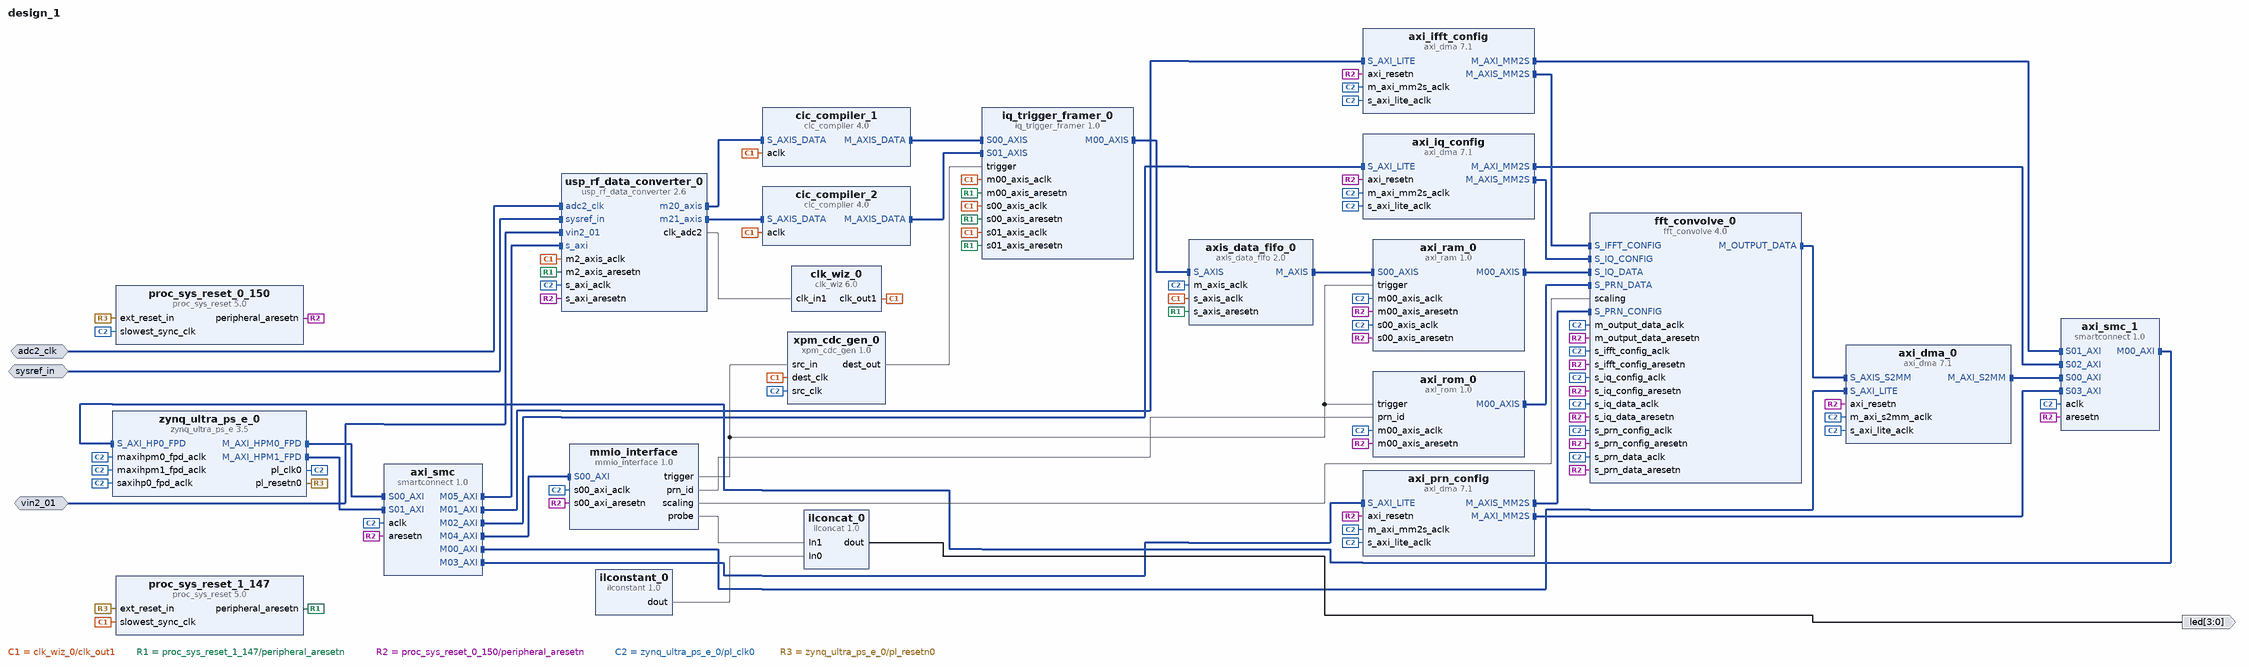
[diagram p0: block diagram of the top level]
# Vivado block design design_1, xczu48dr-ffvg1517-2-e, Vivado 2025.1
create_bd_design design_1

create_bd_intf_port -mode Slave -vlnv xilinx.com:display_usp_rf_data_converter:diff_pins_rtl:1.0 sysref_in
create_bd_intf_port -mode Slave -vlnv xilinx.com:interface:diff_clock_rtl:1.0 adc2_clk
set_property -dict {CONFIG.FREQ_HZ 491520000.0} [get_bd_intf_ports adc2_clk]
create_bd_intf_port -mode Slave -vlnv xilinx.com:interface:diff_analog_io_rtl:1.0 vin2_01
create_bd_port -dir O -from 3 -to 0 led

create_bd_cell -type ip -vlnv xilinx.com:ip:zynq_ultra_ps_e:3.5 zynq_ultra_ps_e_0
set_property -dict [list \
  CONFIG.PSU_BANK_0_IO_STANDARD LVCMOS33 \
  CONFIG.PSU_BANK_1_IO_STANDARD LVCMOS18 \
  CONFIG.PSU_BANK_2_IO_STANDARD LVCMOS18 \
  CONFIG.PSU_BANK_3_IO_STANDARD LVCMOS18 \
  CONFIG.PSU_USB3__DUAL_CLOCK_ENABLE 1 \
  CONFIG.PSU__CAN1__PERIPHERAL__ENABLE 0 \
  CONFIG.PSU__CRF_APB__ACPU_CTRL__FREQMHZ 1200 \
  CONFIG.PSU__CRF_APB__ACPU_CTRL__SRCSEL APLL \
  CONFIG.PSU__CRF_APB__APLL_CTRL__SRCSEL PSS_REF_CLK \
  CONFIG.PSU__CRF_APB__DBG_FPD_CTRL__FREQMHZ 250 \
  CONFIG.PSU__CRF_APB__DBG_FPD_CTRL__SRCSEL IOPLL \
  CONFIG.PSU__CRF_APB__DBG_TRACE_CTRL__FREQMHZ 250 \
  CONFIG.PSU__CRF_APB__DBG_TSTMP_CTRL__FREQMHZ 250 \
  CONFIG.PSU__CRF_APB__DBG_TSTMP_CTRL__SRCSEL IOPLL \
  CONFIG.PSU__CRF_APB__DDR_CTRL__FREQMHZ 1200 \
  CONFIG.PSU__CRF_APB__DDR_CTRL__SRCSEL DPLL \
  CONFIG.PSU__CRF_APB__DPDMA_REF_CTRL__FREQMHZ 600 \
  CONFIG.PSU__CRF_APB__DPDMA_REF_CTRL__SRCSEL DPLL \
  CONFIG.PSU__CRF_APB__DPLL_CTRL__SRCSEL PSS_REF_CLK \
  CONFIG.PSU__CRF_APB__DP_AUDIO_REF_CTRL__SRCSEL RPLL \
  CONFIG.PSU__CRF_APB__DP_STC_REF_CTRL__SRCSEL RPLL \
  CONFIG.PSU__CRF_APB__GDMA_REF_CTRL__FREQMHZ 600 \
  CONFIG.PSU__CRF_APB__GDMA_REF_CTRL__SRCSEL DPLL \
  CONFIG.PSU__CRF_APB__GPU_REF_CTRL__FREQMHZ 600 \
  CONFIG.PSU__CRF_APB__TOPSW_LSBUS_CTRL__FREQMHZ 100 \
  CONFIG.PSU__CRF_APB__TOPSW_LSBUS_CTRL__SRCSEL IOPLL \
  CONFIG.PSU__CRF_APB__TOPSW_MAIN_CTRL__FREQMHZ 533.33 \
  CONFIG.PSU__CRF_APB__TOPSW_MAIN_CTRL__SRCSEL DPLL \
  CONFIG.PSU__CRF_APB__VPLL_CTRL__SRCSEL PSS_REF_CLK \
  CONFIG.PSU__CRL_APB__ADMA_REF_CTRL__FREQMHZ 533.333 \
  CONFIG.PSU__CRL_APB__ADMA_REF_CTRL__SRCSEL RPLL \
  CONFIG.PSU__CRL_APB__CAN1_REF_CTRL__SRCSEL IOPLL \
  CONFIG.PSU__CRL_APB__CPU_R5_CTRL__FREQMHZ 500 \
  CONFIG.PSU__CRL_APB__CPU_R5_CTRL__SRCSEL IOPLL \
  CONFIG.PSU__CRL_APB__DBG_LPD_CTRL__FREQMHZ 250 \
  CONFIG.PSU__CRL_APB__DBG_LPD_CTRL__SRCSEL IOPLL \
  CONFIG.PSU__CRL_APB__GEM3_REF_CTRL__FREQMHZ 125 \
  CONFIG.PSU__CRL_APB__GEM3_REF_CTRL__SRCSEL IOPLL \
  CONFIG.PSU__CRL_APB__I2C1_REF_CTRL__FREQMHZ 100 \
  CONFIG.PSU__CRL_APB__I2C1_REF_CTRL__SRCSEL IOPLL \
  CONFIG.PSU__CRL_APB__IOPLL_CTRL__SRCSEL PSS_REF_CLK \
  CONFIG.PSU__CRL_APB__IOU_SWITCH_CTRL__FREQMHZ 267 \
  CONFIG.PSU__CRL_APB__IOU_SWITCH_CTRL__SRCSEL RPLL \
  CONFIG.PSU__CRL_APB__LPD_LSBUS_CTRL__FREQMHZ 100 \
  CONFIG.PSU__CRL_APB__LPD_LSBUS_CTRL__SRCSEL IOPLL \
  CONFIG.PSU__CRL_APB__LPD_SWITCH_CTRL__FREQMHZ 533.333 \
  CONFIG.PSU__CRL_APB__LPD_SWITCH_CTRL__SRCSEL RPLL \
  CONFIG.PSU__CRL_APB__PCAP_CTRL__FREQMHZ 200 \
  CONFIG.PSU__CRL_APB__PCAP_CTRL__SRCSEL IOPLL \
  CONFIG.PSU__CRL_APB__PL0_REF_CTRL__FREQMHZ 150 \
  CONFIG.PSU__CRL_APB__PL0_REF_CTRL__SRCSEL RPLL \
  CONFIG.PSU__CRL_APB__QSPI_REF_CTRL__FREQMHZ 125 \
  CONFIG.PSU__CRL_APB__RPLL_CTRL__SRCSEL PSS_REF_CLK \
  CONFIG.PSU__CRL_APB__SDIO0_REF_CTRL__SRCSEL IOPLL \
  CONFIG.PSU__CRL_APB__SDIO1_REF_CTRL__FREQMHZ 200 \
  CONFIG.PSU__CRL_APB__SDIO1_REF_CTRL__SRCSEL IOPLL \
  CONFIG.PSU__CRL_APB__SPI0_REF_CTRL__SRCSEL IOPLL \
  CONFIG.PSU__CRL_APB__SPI1_REF_CTRL__SRCSEL IOPLL \
  CONFIG.PSU__CRL_APB__TIMESTAMP_REF_CTRL__FREQMHZ 100 \
  CONFIG.PSU__CRL_APB__TIMESTAMP_REF_CTRL__SRCSEL PSS_REF_CLK \
  CONFIG.PSU__CRL_APB__UART0_REF_CTRL__FREQMHZ 100 \
  CONFIG.PSU__CRL_APB__UART0_REF_CTRL__SRCSEL IOPLL \
  CONFIG.PSU__CRL_APB__USB0_BUS_REF_CTRL__FREQMHZ 250 \
  CONFIG.PSU__CRL_APB__USB0_BUS_REF_CTRL__SRCSEL IOPLL \
  CONFIG.PSU__CRL_APB__USB3_DUAL_REF_CTRL__FREQMHZ 20 \
  CONFIG.PSU__CRL_APB__USB3_DUAL_REF_CTRL__SRCSEL IOPLL \
  CONFIG.PSU__CRL_APB__USB3__ENABLE 1 \
  CONFIG.PSU__DDRC__BUS_WIDTH {64 Bit} \
  CONFIG.PSU__DDRC__COMPONENTS Components \
  CONFIG.PSU__DDRC__DEVICE_CAPACITY {8192 MBits} \
  CONFIG.PSU__DDRC__DRAM_WIDTH {16 Bits} \
  CONFIG.PSU__DDRC__ECC Disabled \
  CONFIG.PSU__DDRC__MEMORY_TYPE {DDR 4} \
  CONFIG.PSU__DDRC__SPEED_BIN DDR4_2400R \
  CONFIG.PSU__DDR_HIGH_ADDRESS_GUI_ENABLE 1 \
  CONFIG.PSU__DDR__INTERFACE__FREQMHZ 600.000 \
  CONFIG.PSU__DISPLAYPORT__LANE0__ENABLE 1 \
  CONFIG.PSU__DISPLAYPORT__LANE0__IO {GT Lane1} \
  CONFIG.PSU__DISPLAYPORT__LANE1__ENABLE 1 \
  CONFIG.PSU__DISPLAYPORT__LANE1__IO {GT Lane0} \
  CONFIG.PSU__DISPLAYPORT__PERIPHERAL__ENABLE 1 \
  CONFIG.PSU__DLL__ISUSED 1 \
  CONFIG.PSU__DPAUX__PERIPHERAL__ENABLE 1 \
  CONFIG.PSU__DPAUX__PERIPHERAL__IO {MIO 27 .. 30} \
  CONFIG.PSU__DP__LANE_SEL {Dual Lower} \
  CONFIG.PSU__DP__REF_CLK_FREQ 27 \
  CONFIG.PSU__DP__REF_CLK_SEL {Ref Clk0} \
  CONFIG.PSU__ENET1__GRP_MDIO__ENABLE 1 \
  CONFIG.PSU__ENET1__GRP_MDIO__IO {MIO 50 .. 51} \
  CONFIG.PSU__ENET1__PERIPHERAL__ENABLE 1 \
  CONFIG.PSU__ENET1__PERIPHERAL__IO {MIO 38 .. 49} \
  CONFIG.PSU__FPGA_PL0_ENABLE 1 \
  CONFIG.PSU__GEM__TSU__ENABLE 0 \
  CONFIG.PSU__GPIO0_MIO__PERIPHERAL__ENABLE 0 \
  CONFIG.PSU__GPIO1_MIO__PERIPHERAL__ENABLE 0 \
  CONFIG.PSU__GT__LINK_SPEED HBR \
  CONFIG.PSU__GT__PRE_EMPH_LVL_4 0 \
  CONFIG.PSU__GT__VLT_SWNG_LVL_4 0 \
  CONFIG.PSU__I2C0__PERIPHERAL__ENABLE 1 \
  CONFIG.PSU__I2C0__PERIPHERAL__IO {MIO 18 .. 19} \
  CONFIG.PSU__I2C1__PERIPHERAL__ENABLE 1 \
  CONFIG.PSU__I2C1__PERIPHERAL__IO {MIO 36 .. 37} \
  CONFIG.PSU__MAXIGP0__DATA_WIDTH 128 \
  CONFIG.PSU__OVERRIDE__BASIC_CLOCK 0 \
  CONFIG.PSU__PMU__PERIPHERAL__ENABLE 0 \
  CONFIG.PSU__PRESET_APPLIED 1 \
  CONFIG.PSU__PSS_REF_CLK__FREQMHZ 33.33333 \
  CONFIG.PSU__QSPI__PERIPHERAL__ENABLE 0 \
  CONFIG.PSU__SD0__CLK_100_SDR_OTAP_DLY 0x0 \
  CONFIG.PSU__SD0__CLK_200_SDR_OTAP_DLY 0x0 \
  CONFIG.PSU__SD0__CLK_50_DDR_ITAP_DLY 0x0 \
  CONFIG.PSU__SD0__CLK_50_DDR_OTAP_DLY 0x0 \
  CONFIG.PSU__SD0__CLK_50_SDR_ITAP_DLY 0x15 \
  CONFIG.PSU__SD0__CLK_50_SDR_OTAP_DLY 0x5 \
  CONFIG.PSU__SPI0__GRP_SS0__IO {MIO 3} \
  CONFIG.PSU__SPI0__GRP_SS1__ENABLE 1 \
  CONFIG.PSU__SPI0__GRP_SS1__IO {MIO 2} \
  CONFIG.PSU__SPI0__GRP_SS2__ENABLE 1 \
  CONFIG.PSU__SPI0__GRP_SS2__IO {MIO 1} \
  CONFIG.PSU__SPI0__PERIPHERAL__ENABLE 1 \
  CONFIG.PSU__SPI0__PERIPHERAL__IO {MIO 0 .. 5} \
  CONFIG.PSU__SPI1__GRP_SS0__IO {MIO 9} \
  CONFIG.PSU__SPI1__PERIPHERAL__ENABLE 1 \
  CONFIG.PSU__SPI1__PERIPHERAL__IO {MIO 6 .. 11} \
  CONFIG.PSU__TSU__BUFG_PORT_PAIR 0 \
  CONFIG.PSU__UART0__PERIPHERAL__ENABLE 0 \
  CONFIG.PSU__UART1__BAUD_RATE 115200 \
  CONFIG.PSU__UART1__MODEM__ENABLE 0 \
  CONFIG.PSU__UART1__PERIPHERAL__ENABLE 1 \
  CONFIG.PSU__UART1__PERIPHERAL__IO {MIO 32 .. 33} \
  CONFIG.PSU__USB0_COHERENCY 0 \
  CONFIG.PSU__USB0__PERIPHERAL__ENABLE 1 \
  CONFIG.PSU__USB0__PERIPHERAL__IO {MIO 52 .. 63} \
  CONFIG.PSU__USB0__REF_CLK_FREQ 100 \
  CONFIG.PSU__USB0__REF_CLK_SEL {Ref Clk1} \
  CONFIG.PSU__USB1__PERIPHERAL__ENABLE 1 \
  CONFIG.PSU__USB1__PERIPHERAL__IO {MIO 64 .. 75} \
  CONFIG.PSU__USB1__REF_CLK_FREQ 100 \
  CONFIG.PSU__USB1__REF_CLK_SEL {Ref Clk1} \
  CONFIG.PSU__USB2_0__EMIO__ENABLE 0 \
  CONFIG.PSU__USB3_0__EMIO__ENABLE 0 \
  CONFIG.PSU__USB3_0__PERIPHERAL__ENABLE 1 \
  CONFIG.PSU__USB3_0__PERIPHERAL__IO {GT Lane2} \
  CONFIG.PSU__USB3_1__PERIPHERAL__ENABLE 1 \
  CONFIG.PSU__USB3_1__PERIPHERAL__IO {GT Lane3} \
  CONFIG.PSU__USB__RESET__MODE {Boot Pin} \
  CONFIG.PSU__USB__RESET__POLARITY {Active Low} \
  CONFIG.PSU__USE__IRQ0 1 \
  CONFIG.PSU__USE__IRQ1 1 \
  CONFIG.PSU__USE__M_AXI_GP0 1 \
  CONFIG.PSU__USE__M_AXI_GP1 1 \
  CONFIG.PSU__USE__M_AXI_GP2 0 \
  CONFIG.PSU__USE__S_AXI_GP2 1 \
] [get_bd_cells zynq_ultra_ps_e_0]
# 103 more settings of zynq_ultra_ps_e_0 are not shown: defaults, MIO pin electricals, DDR timing, and values the tool derives
create_bd_cell -type ip -vlnv xilinx.com:ip:axi_dma:7.1 axi_dma_0
set_property -dict {CONFIG.c_include_mm2s 0 CONFIG.c_include_sg 0 CONFIG.c_sg_length_width 23} [get_bd_cells axi_dma_0]
create_bd_cell -type ip -vlnv xilinx.com:ip:clk_wiz:6.0 clk_wiz_0
set_property -dict [list \
  CONFIG.CLKIN1_JITTER_PS 39.06 \
  CONFIG.CLKOUT1_JITTER 131.681 \
  CONFIG.CLKOUT1_PHASE_ERROR 150.915 \
  CONFIG.CLKOUT1_REQUESTED_OUT_FREQ 102.4 \
  CONFIG.MMCM_CLKFBOUT_MULT_F 23.500 \
  CONFIG.MMCM_CLKIN1_PERIOD 3.906 \
  CONFIG.MMCM_CLKIN2_PERIOD 10.0 \
  CONFIG.MMCM_CLKOUT0_DIVIDE_F 11.750 \
  CONFIG.MMCM_DIVCLK_DIVIDE 5 \
  CONFIG.PRIM_IN_FREQ 256 \
  CONFIG.PRIM_SOURCE Single_ended_clock_capable_pin \
  CONFIG.USE_LOCKED false \
  CONFIG.USE_RESET false \
] [get_bd_cells clk_wiz_0]
create_bd_cell -type ip -vlnv xilinx.com:ip:axis_data_fifo:2.0 axis_data_fifo_0
set_property -dict [list \
  CONFIG.FIFO_DEPTH 4096 \
  CONFIG.HAS_TLAST 1 \
  CONFIG.IS_ACLK_ASYNC 1 \
  CONFIG.TDATA_NUM_BYTES 4 \
] [get_bd_cells axis_data_fifo_0]
create_bd_cell -type ip -vlnv xilinx.com:ip:proc_sys_reset:5.0 proc_sys_reset_0_150
create_bd_cell -type ip -vlnv xilinx.com:ip:proc_sys_reset:5.0 proc_sys_reset_1_147
create_bd_cell -type ip -vlnv xilinx.com:ip:usp_rf_data_converter:2.6 usp_rf_data_converter_0
set_property -dict [list \
  CONFIG.ADC226_En true \
  CONFIG.ADC2_Clock_Dist 2 \
  CONFIG.Axiclk_Freq 150 \
  CONFIG.Converter_Setup 0 \
  CONFIG.RF_Analyzer 0 \
  CONFIG.mADC_CalOpt_Mode00 2 \
  CONFIG.mADC_Data_Type00 1 \
  CONFIG.mADC_Data_Width00 1 \
  CONFIG.mADC_Decimation_Mode00 40 \
  CONFIG.mADC_Dither00 false \
  CONFIG.mADC_Mixer_Type00 2 \
  CONFIG.mADC_Outclk_Freq 256.000 \
  CONFIG.mADC_PLL_Enable true \
  CONFIG.mADC_Refclk_Freq 491.520 \
  CONFIG.mADC_Sampling_Rate 4.096 \
  CONFIG.mADC_Slice00_Enable true \
] [get_bd_cells usp_rf_data_converter_0]
create_bd_cell -type ip -vlnv xilinx.com:ip:cic_compiler:4.0 cic_compiler_1
set_property -dict [list \
  CONFIG.Clock_Frequency 102.4 \
  CONFIG.Filter_Type Decimation \
  CONFIG.Fixed_Or_Initial_Rate 25 \
  CONFIG.Input_Data_Width 16 \
  CONFIG.Input_Sample_Frequency 102.4 \
  CONFIG.Maximum_Rate 25 \
  CONFIG.Minimum_Rate 25 \
  CONFIG.Number_Of_Stages 6 \
  CONFIG.Output_Data_Width 16 \
  CONFIG.Quantization Truncation \
  CONFIG.SamplePeriod 1 \
  CONFIG.Sample_Rate_Changes Fixed \
] [get_bd_cells cic_compiler_1]
create_bd_cell -type ip -vlnv xilinx.com:ip:cic_compiler:4.0 cic_compiler_2
set_property -dict [list \
  CONFIG.Clock_Frequency 102.4 \
  CONFIG.Filter_Type Decimation \
  CONFIG.Fixed_Or_Initial_Rate 25 \
  CONFIG.Input_Data_Width 16 \
  CONFIG.Input_Sample_Frequency 102.4 \
  CONFIG.Maximum_Rate 25 \
  CONFIG.Minimum_Rate 25 \
  CONFIG.Number_Of_Stages 6 \
  CONFIG.Output_Data_Width 16 \
  CONFIG.Quantization Truncation \
  CONFIG.SamplePeriod 1 \
  CONFIG.Sample_Rate_Changes Fixed \
] [get_bd_cells cic_compiler_2]
create_bd_cell -type ip -vlnv user.org:user:iq_trigger_framer:1.0 iq_trigger_framer_0
create_bd_cell -type ip -vlnv user.org:user:axi_rom:1.0 axi_rom_0
create_bd_cell -type ip -vlnv user.org:user:axi_ram:1.0 axi_ram_0
create_bd_cell -type ip -vlnv user.org:user:fft_convolve:4.0 fft_convolve_0
create_bd_cell -type ip -vlnv user.org:user:mmio_interface:1.0 mmio_interface
create_bd_cell -type ip -vlnv xilinx.com:ip:axi_dma:7.1 axi_prn_config
set_property -dict [list \
  CONFIG.c_include_s2mm 0 \
  CONFIG.c_include_sg 0 \
  CONFIG.c_m_axis_mm2s_tdata_width 8 \
  CONFIG.c_sg_length_width 23 \
] [get_bd_cells axi_prn_config]
create_bd_cell -type ip -vlnv xilinx.com:ip:axi_dma:7.1 axi_iq_config
set_property -dict [list \
  CONFIG.c_include_s2mm 0 \
  CONFIG.c_include_sg 0 \
  CONFIG.c_m_axis_mm2s_tdata_width 8 \
  CONFIG.c_sg_length_width 23 \
] [get_bd_cells axi_iq_config]
create_bd_cell -type ip -vlnv xilinx.com:ip:axi_dma:7.1 axi_ifft_config
set_property -dict [list \
  CONFIG.c_include_s2mm 0 \
  CONFIG.c_include_sg 0 \
  CONFIG.c_m_axis_mm2s_tdata_width 8 \
  CONFIG.c_sg_length_width 23 \
] [get_bd_cells axi_ifft_config]
create_bd_cell -type ip -vlnv xilinx.com:ip:xpm_cdc_gen:1.0 xpm_cdc_gen_0
set_property -dict [list \
  CONFIG.CDC_TYPE xpm_cdc_single \
  CONFIG.SIM_ASSERT_CHK false \
  CONFIG.SRC_INPUT_REG false \
] [get_bd_cells xpm_cdc_gen_0]
create_bd_cell -type inline_hdl -vlnv xilinx.com:inline_hdl:ilconcat:1.0 ilconcat_0
set_property -dict {CONFIG.IN0_WIDTH 3} [get_bd_cells ilconcat_0]
create_bd_cell -type inline_hdl -vlnv xilinx.com:inline_hdl:ilconstant:1.0 ilconstant_0
set_property -dict {CONFIG.CONST_VAL 4 CONFIG.CONST_WIDTH 3} [get_bd_cells ilconstant_0]
create_bd_cell -type ip -vlnv xilinx.com:ip:smartconnect:1.0 axi_smc_1
set_property -dict {CONFIG.NUM_SI 4} [get_bd_cells axi_smc_1]
create_bd_cell -type ip -vlnv xilinx.com:ip:smartconnect:1.0 axi_smc
set_property -dict {CONFIG.NUM_MI 6 CONFIG.NUM_SI 2} [get_bd_cells axi_smc]

# ---- connections ----

connect_bd_intf_net [get_bd_intf_ports adc2_clk] [get_bd_intf_pins usp_rf_data_converter_0/adc2_clk]
connect_bd_intf_net [get_bd_intf_pins axi_dma_0/M_AXI_S2MM] [get_bd_intf_pins axi_smc_1/S00_AXI]
connect_bd_intf_net [get_bd_intf_pins axi_ifft_config/M_AXIS_MM2S] [get_bd_intf_pins fft_convolve_0/S_IFFT_CONFIG]
connect_bd_intf_net [get_bd_intf_pins axi_ifft_config/M_AXI_MM2S] [get_bd_intf_pins axi_smc_1/S01_AXI]
connect_bd_intf_net [get_bd_intf_pins axi_iq_config/M_AXIS_MM2S] [get_bd_intf_pins fft_convolve_0/S_IQ_CONFIG]
connect_bd_intf_net [get_bd_intf_pins axi_iq_config/M_AXI_MM2S] [get_bd_intf_pins axi_smc_1/S02_AXI]
connect_bd_intf_net [get_bd_intf_pins axi_prn_config/M_AXIS_MM2S] [get_bd_intf_pins fft_convolve_0/S_PRN_CONFIG]
connect_bd_intf_net [get_bd_intf_pins axi_prn_config/M_AXI_MM2S] [get_bd_intf_pins axi_smc_1/S03_AXI]
connect_bd_intf_net [get_bd_intf_pins axi_ram_0/M00_AXIS] [get_bd_intf_pins fft_convolve_0/S_IQ_DATA]
connect_bd_intf_net [get_bd_intf_pins axi_rom_0/M00_AXIS] [get_bd_intf_pins fft_convolve_0/S_PRN_DATA]
connect_bd_intf_net [get_bd_intf_pins axi_smc_1/M00_AXI] [get_bd_intf_pins zynq_ultra_ps_e_0/S_AXI_HP0_FPD]
connect_bd_intf_net [get_bd_intf_pins axi_smc/M00_AXI] [get_bd_intf_pins axi_dma_0/S_AXI_LITE]
connect_bd_intf_net [get_bd_intf_pins axi_smc/M01_AXI] [get_bd_intf_pins axi_ifft_config/S_AXI_LITE]
connect_bd_intf_net [get_bd_intf_pins axi_smc/M02_AXI] [get_bd_intf_pins axi_iq_config/S_AXI_LITE]
connect_bd_intf_net [get_bd_intf_pins axi_smc/M03_AXI] [get_bd_intf_pins axi_prn_config/S_AXI_LITE]
connect_bd_intf_net [get_bd_intf_pins axi_smc/M04_AXI] [get_bd_intf_pins mmio_interface/S00_AXI]
connect_bd_intf_net [get_bd_intf_pins axi_smc/M05_AXI] [get_bd_intf_pins usp_rf_data_converter_0/s_axi]
connect_bd_intf_net [get_bd_intf_pins axis_data_fifo_0/M_AXIS] [get_bd_intf_pins axi_ram_0/S00_AXIS]
connect_bd_intf_net [get_bd_intf_pins cic_compiler_1/M_AXIS_DATA] [get_bd_intf_pins iq_trigger_framer_0/S00_AXIS]
connect_bd_intf_net [get_bd_intf_pins cic_compiler_2/M_AXIS_DATA] [get_bd_intf_pins iq_trigger_framer_0/S01_AXIS]
connect_bd_intf_net [get_bd_intf_pins fft_convolve_0/M_OUTPUT_DATA] [get_bd_intf_pins axi_dma_0/S_AXIS_S2MM]
connect_bd_intf_net [get_bd_intf_pins axis_data_fifo_0/S_AXIS] [get_bd_intf_pins iq_trigger_framer_0/M00_AXIS]
connect_bd_intf_net [get_bd_intf_ports sysref_in] [get_bd_intf_pins usp_rf_data_converter_0/sysref_in]
connect_bd_intf_net [get_bd_intf_pins usp_rf_data_converter_0/m20_axis] [get_bd_intf_pins cic_compiler_1/S_AXIS_DATA]
connect_bd_intf_net [get_bd_intf_pins usp_rf_data_converter_0/m21_axis] [get_bd_intf_pins cic_compiler_2/S_AXIS_DATA]
connect_bd_intf_net -intf_net vin2_01_1 [get_bd_intf_ports vin2_01] [get_bd_intf_pins usp_rf_data_converter_0/vin2_01]
connect_bd_intf_net [get_bd_intf_pins zynq_ultra_ps_e_0/M_AXI_HPM0_FPD] [get_bd_intf_pins axi_smc/S00_AXI]
connect_bd_intf_net [get_bd_intf_pins zynq_ultra_ps_e_0/M_AXI_HPM1_FPD] [get_bd_intf_pins axi_smc/S01_AXI]
connect_bd_net -net bram_interface_probe [get_bd_pins mmio_interface/probe] [get_bd_pins ilconcat_0/In1]
connect_bd_net [get_bd_pins clk_wiz_0/clk_out1] \
  [get_bd_pins proc_sys_reset_1_147/slowest_sync_clk] [get_bd_pins axis_data_fifo_0/s_axis_aclk] \
  [get_bd_pins usp_rf_data_converter_0/m2_axis_aclk] [get_bd_pins cic_compiler_1/aclk] [get_bd_pins cic_compiler_2/aclk] \
  [get_bd_pins iq_trigger_framer_0/s00_axis_aclk] [get_bd_pins iq_trigger_framer_0/s01_axis_aclk] \
  [get_bd_pins iq_trigger_framer_0/m00_axis_aclk] [get_bd_pins xpm_cdc_gen_0/dest_clk]
connect_bd_net [get_bd_pins ilconcat_0/dout] [get_bd_ports led]
connect_bd_net [get_bd_pins ilconstant_0/dout] [get_bd_pins ilconcat_0/In0]
connect_bd_net -net mmio_interface_0_prn_id [get_bd_pins mmio_interface/prn_id] [get_bd_pins axi_rom_0/prn_id]
connect_bd_net -net mmio_interface_0_scaling [get_bd_pins mmio_interface/scaling] [get_bd_pins fft_convolve_0/scaling]
connect_bd_net -net mmio_interface_0_trigger [get_bd_pins mmio_interface/trigger] \
  [get_bd_pins axi_rom_0/trigger] [get_bd_pins axi_ram_0/trigger] [get_bd_pins xpm_cdc_gen_0/src_in]
connect_bd_net -net proc_sys_reset_0_150_mb_reset [get_bd_pins proc_sys_reset_1_147/peripheral_aresetn] \
  [get_bd_pins axis_data_fifo_0/s_axis_aresetn] [get_bd_pins usp_rf_data_converter_0/m2_axis_aresetn] \
  [get_bd_pins iq_trigger_framer_0/s00_axis_aresetn] [get_bd_pins iq_trigger_framer_0/s01_axis_aresetn] \
  [get_bd_pins iq_trigger_framer_0/m00_axis_aresetn]
connect_bd_net [get_bd_pins proc_sys_reset_0_150/peripheral_aresetn] \
  [get_bd_pins axi_dma_0/axi_resetn] [get_bd_pins usp_rf_data_converter_0/s_axi_aresetn] \
  [get_bd_pins axi_ifft_config/axi_resetn] [get_bd_pins axi_iq_config/axi_resetn] [get_bd_pins axi_prn_config/axi_resetn] \
  [get_bd_pins axi_ram_0/m00_axis_aresetn] [get_bd_pins axi_ram_0/s00_axis_aresetn] [get_bd_pins axi_rom_0/m00_axis_aresetn] \
  [get_bd_pins mmio_interface/s00_axi_aresetn] [get_bd_pins axi_smc_1/aresetn] [get_bd_pins axi_smc/aresetn] \
  [get_bd_pins fft_convolve_0/s_prn_data_aresetn] [get_bd_pins fft_convolve_0/s_prn_config_aresetn] \
  [get_bd_pins fft_convolve_0/s_iq_data_aresetn] [get_bd_pins fft_convolve_0/s_iq_config_aresetn] \
  [get_bd_pins fft_convolve_0/s_ifft_config_aresetn] [get_bd_pins fft_convolve_0/m_output_data_aresetn]
connect_bd_net [get_bd_pins usp_rf_data_converter_0/clk_adc2] [get_bd_pins clk_wiz_0/clk_in1]
connect_bd_net [get_bd_pins xpm_cdc_gen_0/dest_out] [get_bd_pins iq_trigger_framer_0/trigger]
connect_bd_net [get_bd_pins zynq_ultra_ps_e_0/pl_clk0] \
  [get_bd_pins proc_sys_reset_0_150/slowest_sync_clk] [get_bd_pins axi_dma_0/s_axi_lite_aclk] \
  [get_bd_pins axi_dma_0/m_axi_s2mm_aclk] [get_bd_pins axis_data_fifo_0/m_axis_aclk] \
  [get_bd_pins zynq_ultra_ps_e_0/maxihpm0_fpd_aclk] [get_bd_pins zynq_ultra_ps_e_0/maxihpm1_fpd_aclk] \
  [get_bd_pins zynq_ultra_ps_e_0/saxihp0_fpd_aclk] [get_bd_pins usp_rf_data_converter_0/s_axi_aclk] \
  [get_bd_pins axi_ifft_config/m_axi_mm2s_aclk] [get_bd_pins axi_ifft_config/s_axi_lite_aclk] \
  [get_bd_pins axi_iq_config/m_axi_mm2s_aclk] [get_bd_pins axi_iq_config/s_axi_lite_aclk] \
  [get_bd_pins axi_prn_config/m_axi_mm2s_aclk] [get_bd_pins axi_prn_config/s_axi_lite_aclk] \
  [get_bd_pins axi_ram_0/m00_axis_aclk] [get_bd_pins axi_ram_0/s00_axis_aclk] [get_bd_pins axi_rom_0/m00_axis_aclk] \
  [get_bd_pins xpm_cdc_gen_0/src_clk] [get_bd_pins mmio_interface/s00_axi_aclk] [get_bd_pins axi_smc_1/aclk] \
  [get_bd_pins axi_smc/aclk] [get_bd_pins fft_convolve_0/s_prn_data_aclk] [get_bd_pins fft_convolve_0/s_prn_config_aclk] \
  [get_bd_pins fft_convolve_0/s_iq_data_aclk] [get_bd_pins fft_convolve_0/s_iq_config_aclk] \
  [get_bd_pins fft_convolve_0/s_ifft_config_aclk] [get_bd_pins fft_convolve_0/m_output_data_aclk]
connect_bd_net [get_bd_pins zynq_ultra_ps_e_0/pl_resetn0] \
  [get_bd_pins proc_sys_reset_1_147/ext_reset_in] [get_bd_pins proc_sys_reset_0_150/ext_reset_in]

# ---- address map ----
assign_bd_address -offset 0x00000000 -range 2G -target_address_space [get_bd_addr_spaces axi_dma_0/Data_S2MM] [get_bd_addr_segs zynq_ultra_ps_e_0/SAXIGP2/HP0_DDR_LOW]
exclude_bd_addr_seg -offset 0x00000000 -range 1 -target_address_space [get_bd_addr_spaces axi_dma_0/Data_S2MM] [get_bd_addr_segs zynq_ultra_ps_e_0/SAXIGP2/HP0_DDR_HIGH]
exclude_bd_addr_seg -offset 0xFF000000 -range 16M -target_address_space [get_bd_addr_spaces axi_dma_0/Data_S2MM] [get_bd_addr_segs zynq_ultra_ps_e_0/SAXIGP2/HP0_LPS_OCM]
assign_bd_address -offset 0x00000000 -range 2G -target_address_space [get_bd_addr_spaces axi_ifft_config/Data_MM2S] [get_bd_addr_segs zynq_ultra_ps_e_0/SAXIGP2/HP0_DDR_LOW]
exclude_bd_addr_seg -offset 0x00000000 -range 1 -target_address_space [get_bd_addr_spaces axi_ifft_config/Data_MM2S] [get_bd_addr_segs zynq_ultra_ps_e_0/SAXIGP2/HP0_DDR_HIGH]
exclude_bd_addr_seg -offset 0xFF000000 -range 16M -target_address_space [get_bd_addr_spaces axi_ifft_config/Data_MM2S] [get_bd_addr_segs zynq_ultra_ps_e_0/SAXIGP2/HP0_LPS_OCM]
assign_bd_address -offset 0x00000000 -range 2G -target_address_space [get_bd_addr_spaces axi_iq_config/Data_MM2S] [get_bd_addr_segs zynq_ultra_ps_e_0/SAXIGP2/HP0_DDR_LOW]
exclude_bd_addr_seg -offset 0x00000000 -range 1 -target_address_space [get_bd_addr_spaces axi_iq_config/Data_MM2S] [get_bd_addr_segs zynq_ultra_ps_e_0/SAXIGP2/HP0_DDR_HIGH]
exclude_bd_addr_seg -offset 0xFF000000 -range 16M -target_address_space [get_bd_addr_spaces axi_iq_config/Data_MM2S] [get_bd_addr_segs zynq_ultra_ps_e_0/SAXIGP2/HP0_LPS_OCM]
assign_bd_address -offset 0x00000000 -range 2G -target_address_space [get_bd_addr_spaces axi_prn_config/Data_MM2S] [get_bd_addr_segs zynq_ultra_ps_e_0/SAXIGP2/HP0_DDR_LOW]
exclude_bd_addr_seg -offset 0x00000000 -range 1 -target_address_space [get_bd_addr_spaces axi_prn_config/Data_MM2S] [get_bd_addr_segs zynq_ultra_ps_e_0/SAXIGP2/HP0_DDR_HIGH]
exclude_bd_addr_seg -offset 0xFF000000 -range 16M -target_address_space [get_bd_addr_spaces axi_prn_config/Data_MM2S] [get_bd_addr_segs zynq_ultra_ps_e_0/SAXIGP2/HP0_LPS_OCM]
assign_bd_address -offset 0x00A0000000 -range 64K -target_address_space [get_bd_addr_spaces zynq_ultra_ps_e_0/Data] [get_bd_addr_segs axi_dma_0/S_AXI_LITE/Reg]
assign_bd_address -offset 0x00A0010000 -range 64K -target_address_space [get_bd_addr_spaces zynq_ultra_ps_e_0/Data] [get_bd_addr_segs axi_ifft_config/S_AXI_LITE/Reg]
assign_bd_address -offset 0x00A0020000 -range 64K -target_address_space [get_bd_addr_spaces zynq_ultra_ps_e_0/Data] [get_bd_addr_segs axi_iq_config/S_AXI_LITE/Reg]
assign_bd_address -offset 0x00A0030000 -range 64K -target_address_space [get_bd_addr_spaces zynq_ultra_ps_e_0/Data] [get_bd_addr_segs axi_prn_config/S_AXI_LITE/Reg]
assign_bd_address -offset 0x00A0040000 -range 256K -target_address_space [get_bd_addr_spaces zynq_ultra_ps_e_0/Data] [get_bd_addr_segs usp_rf_data_converter_0/s_axi/Reg]
assign_bd_address -offset 0x00A0080000 -range 64K -target_address_space [get_bd_addr_spaces zynq_ultra_ps_e_0/Data] [get_bd_addr_segs mmio_interface/S00_AXI/S00_AXI_reg]

validate_bd_design
save_bd_design
